# Altium schematic sheet LPF_Interface.SchDoc
size A4; SheetNumber: 15; SheetTotal: 16
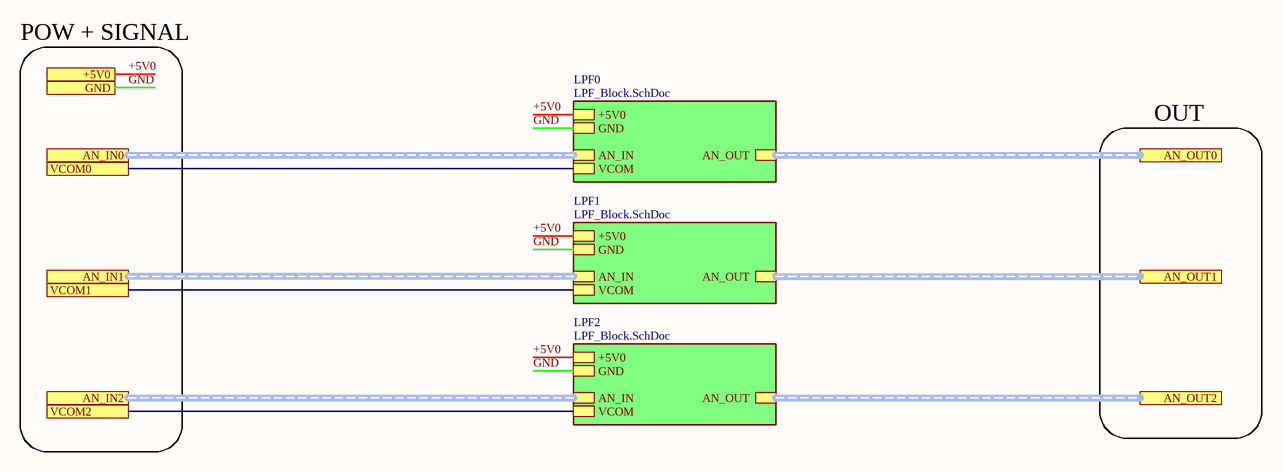
[diagram p0: LPF_Interface.SchDoc]

## Sub-sheets
LPF0 = LPF_Block.SchDoc: GND, +5V0, VCOM, AN_IN (harness AN), AN_OUT (harness AN)
LPF1 = LPF_Block.SchDoc: GND, +5V0, VCOM, AN_IN (harness AN), AN_OUT (harness AN)
LPF2 = LPF_Block.SchDoc: GND, +5V0, VCOM, AN_IN (harness AN), AN_OUT (harness AN)

## Ports
+5V0 (see AudioDSP-v3.1.1_top[7B], LPF_Block[1B]), AN_IN0 (harness AN, see AudioDSP-v3.1.1_top[7B]), AN_IN1 (harness AN, see AudioDSP-v3.1.1_top[7B]), AN_IN2 (harness AN, see AudioDSP-v3.1.1_top[7B]), AN_OUT0 (harness AN, see AudioDSP-v3.1.1_top[7B]), AN_OUT1 (harness AN, see AudioDSP-v3.1.1_top[7B]), AN_OUT2 (harness AN, see AudioDSP-v3.1.1_top[7B]), GND (see AudioDSP-v3.1.1_top[7B], LPF_Block[1B]), VCOM0 (see AudioDSP-v3.1.1_top[7B]), VCOM1 (see AudioDSP-v3.1.1_top[7B]), VCOM2 (see AudioDSP-v3.1.1_top[7B])

## Nets
+5V0: port +5V0, sheet LPF0/+5V0, sheet LPF1/+5V0, sheet LPF2/+5V0
GND: port GND, sheet LPF0/GND, sheet LPF1/GND, sheet LPF2/GND
VCOM0: port VCOM0, sheet LPF0/VCOM
VCOM1: port VCOM1, sheet LPF1/VCOM
VCOM2: port VCOM2, sheet LPF2/VCOM

## Buses and harness runs
harness port AN_IN0 = sheet LPF0/AN_IN
harness port AN_IN1 = sheet LPF1/AN_IN
harness port AN_IN2 = sheet LPF2/AN_IN
harness port AN_OUT0 = sheet LPF0/AN_OUT
harness port AN_OUT1 = sheet LPF1/AN_OUT
harness port AN_OUT2 = sheet LPF2/AN_OUT

## Notes on the sheet
- POW + SIGNAL
- OUT